# EAGLE design gnd-station_2023-2024_jlangl (EAGLE 9.7.0)
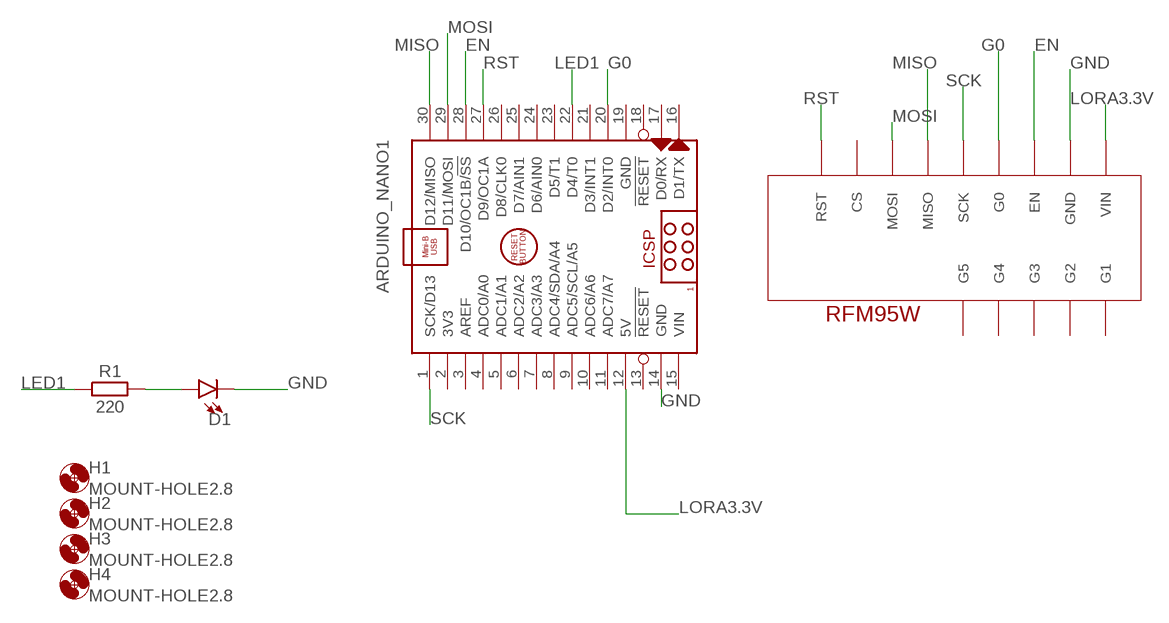
[diagram p0: schematic, sheet 1]

## Parts
ARDUINO_NANO1  ARDUINO_NANO  [ARDUINO_NANO]
D1  LED1206-BOTTOM  [LED-1206-BOTTOM]
H1  MOUNT-HOLE2.8  [2,8]
H2  MOUNT-HOLE2.8  [2,8]
H3  MOUNT-HOLE2.8  [2,8]
H4  MOUNT-HOLE2.8  [2,8]
R1  220  R_AXIAL-7.2MM-PITCH  [RESAD724W46L381D178B]
U1  ADAFRUIT_RFM95W_LORA_RADIO  [ADAFRUIT_RFM95W_LORA_RADIO]

## Nets
EN: ARDUINO_NANO1.28(D10/OC1B/!SS) U1.3(EN)
G0: ARDUINO_NANO1.20(D2/INT0) U1.4(G0)
GND: ARDUINO_NANO1.14(GND) D1.C U1.2(GND)
LED1: ARDUINO_NANO1.22(D4/T0) R1.1
LORA3.3V: ARDUINO_NANO1.12(5V) U1.1(VIN)
MISO: ARDUINO_NANO1.30(D12/MISO) U1.6(MISO)
MOSI: ARDUINO_NANO1.29(D11/MOSI) U1.7(MOSI)
N$2: D1.A R1.2
RST: ARDUINO_NANO1.27(D9/OC1A) U1.9(RST)
SCK: ARDUINO_NANO1.1(SCK/D13) U1.5(SCK)
Unconnected: ARDUINO_NANO1.2(3V3) ARDUINO_NANO1.3(AREF) ARDUINO_NANO1.4(ADC0/A0) ARDUINO_NANO1.5(ADC1/A1) ARDUINO_NANO1.6(ADC2/A2) ARDUINO_NANO1.7(ADC3/A3) ARDUINO_NANO1.8(ADC4/SDA/A4) ARDUINO_NANO1.9(ADC5/SCL/A5) ARDUINO_NANO1.10(ADC6/A6) ARDUINO_NANO1.11(ADC7/A7) ARDUINO_NANO1.13(!RESET) ARDUINO_NANO1.16(D1/TX) ARDUINO_NANO1.17(D0/RX) ARDUINO_NANO1.18(!RESET) ARDUINO_NANO1.21(D3/INT1) ARDUINO_NANO1.23(D5/T1) ARDUINO_NANO1.24(D6/AIN0) ARDUINO_NANO1.25(D7/AIN1) ARDUINO_NANO1.26(D8/CLK0) U1.8(CS) U1.10(G1) U1.11(G2) U1.12(G3) U1.13(G4) U1.14(G5)

## Power pins joined to a net without a drawn wire
GND: ARDUINO_NANO1.19(GND)
VIN: ARDUINO_NANO1.15(VIN)

## Library data of the parts
ARDUINO_NANO1 = ArduinoNanoV30:ARDUINO_NANO: Arduino Nano V3.0 Module Overview: The Arduino Nano is a small, complete, and breadboard-friendly board based on the ATmega328 (Arduino Nano 3.x) or ATmega168 (Arduino Nano 2.x). It has more or less the same functionality of the Arduino Duemilanove, but in a different package. It lacks only a DC power jack, and works with a Mini-B USB cable instead of a standard one. The Nano was designed and is being produced by Gravitech <http://www.gravitech.us/arna30wiatp.html>. General specifications: Item Value Microcontroller Atmel ATmega168 or ATmega328 Operating Voltage (logic level) 5 V Input Voltage (recommended) 7-12 V Input Voltage (limits) 6-20 V Digital I/O Pins 14 (of which 6 provide PWM output) Analog Input Pins 8 DC Current per I/O Pin 40 mA Flash Memory 16 KB (ATmega168) or 32 KB (ATmega328) of which 2 KB used by bootloader SRAM 1 KB (ATmega168) or 2 KB (ATmega328) EEPROM 512 bytes (ATmega168) or 1 KB (ATmega328) Clock Speed 16 MHz Dimensions (Inches) 0.73" x 1.70" Dimensions (mm) 18mm x 45mm Overall height About 9 mm (not including pins) Weigth 5 g Power: The Arduino Nano can be powered via the Mini-B USB connection, 6-20V unregulated external power supply (pin 30), or 5V regulated external power supply (pin 27). The power source is automatically selected to the highest voltage source. Memory: The ATmega168 has 16 KB of flash memory for storing code (of which 2 KB is used for the bootloader); the ATmega328 has 32 KB, (also with 2 KB used for the bootloader). The ATmega168 has 1 KB of SRAM and 512 bytes of EEPROM (which can be read and written with the EEPROM library); the ATmega328 has 2 KB of SRAM and 1 KB of EEPROM. Input and Output: Each of the 14 digital pins on the Nano can be used as an input or output, using pinMode(), digitalWrite(), and digitalRead() functions. They operate at 5 volts. Each pin can provide or receive a maximum of 40 mA and has an internal pull-up resistor (disconnected by default) of 20-50 kOhms. In addition, some pins have specialized functions. Visit Arduino - ArduinoBoardNano <https://www.arduino.cc/en/Main/ArduinoBoardNano>
D1 = SparkFun-LED:LED: LED (Generic) Standard schematic elements and footprints for 5mm, 3mm, 1206, and 0603 sized LEDs. Generic LEDs with no color specified.
H1-H4 = holes:MOUNT-HOLE: MOUNTING HOLE with drill center marker
R1 = Resistor:R: Resistor Fixed - Generic; CATEGORY: Resistor; SUB-CATEGORY: Fixed
U1 = AERO_Eagle_Library:ADAFRUIT_RFM95W_LORA_RADIO: Adafruit's LoRa Radio: RFM95W https://www.adafruit.com/product/3072

## Board
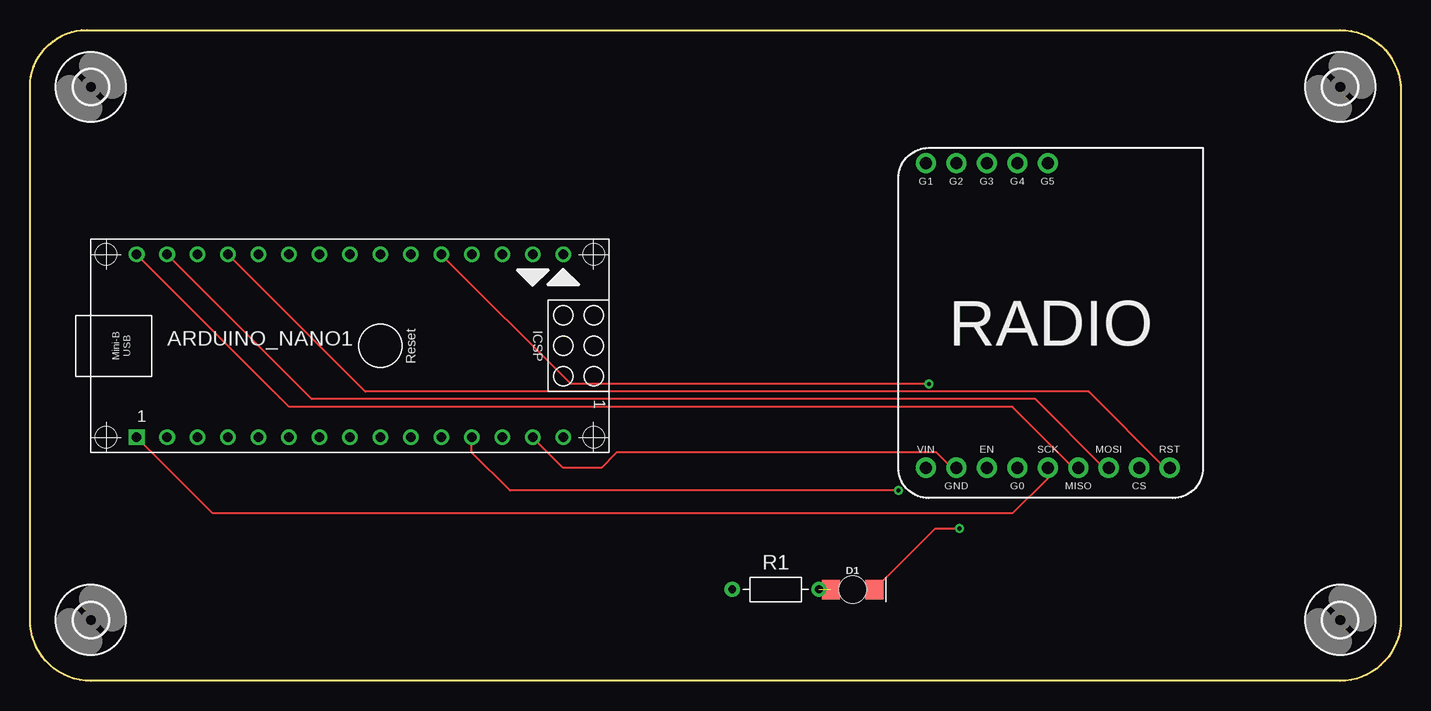
[diagram p1: board, top side]
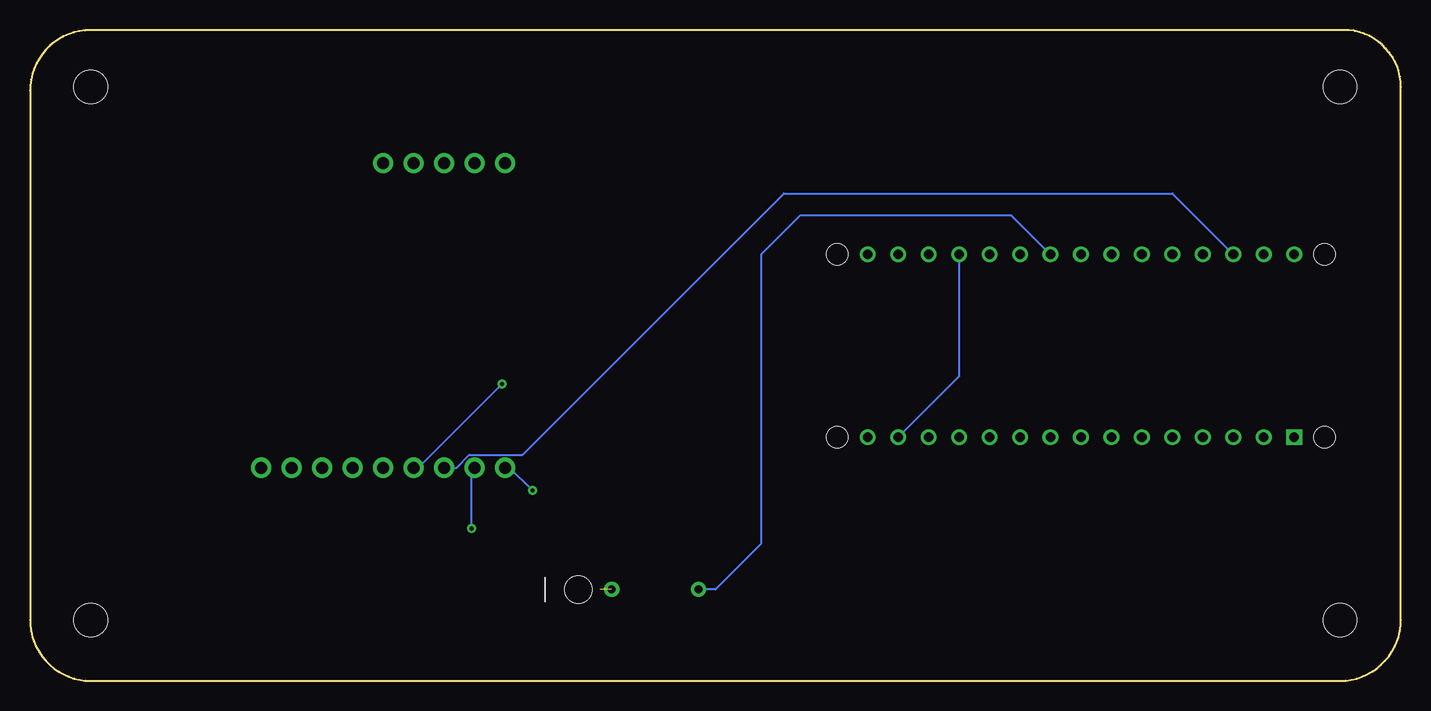
[diagram p2: board, bottom side, seen from below]

Size 114.28 x 54.28 mm. Coordinates in mm from the lower left corner, seen from the top.
Outline: 0,49.53 arc-90 4.75,54.28 109.22,54.28 arc-90 114.28,49.22 114.28,5.08 arc-90 109.2,0 5.08,0 arc-90 0,5.08 0,49.53
Copper layers (1*16): Top / Bottom
Stack-up Default Layer Stack: Top User Defined 0.035mm / Dielectric-1 User Defined 1.5mm / Bottom User Defined 0.035mm
Design rules "default": minimum track width 6mil, minimum drill 0.35mm, track to track 6mil, track to pad 6mil, pad to pad 6mil, via to via 6mil, smd to smd 6mil, copper to edge 40mil, drill to drill 6mil, minimum pad ring 10mil, minimum via ring 8mil, stop-mask expansion 4mil, vias tented up to drill 0mil, thermal gap 10mil

### Footprints (pad centres in the part's own frame; a part is rotated, then mirrored left to right if it is on the bottom)
ARDUINO_NANO = drill 0.8 square: 1 -20.32,-7.62 | drill 0.8: 2 -17.78,-7.62; 3 -15.24,-7.62; 4 -12.7,-7.62; 5 -10.16,-7.62; 6 -7.62,-7.62; 7 -5.08,-7.62; 8 -2.54,-7.62; 9 0,-7.62; 10 2.54,-7.62; 11 5.08,-7.62; 12 7.62,-7.62; 13 10.16,-7.62; 14 12.7,-7.62; 15 15.24,-7.62; 16 15.24,7.62; 17 12.7,7.62; 18 10.16,7.62; 19 7.62,7.62; 20 5.08,7.62; 21 2.54,7.62; 22 0,7.62; 23 -2.54,7.62; 24 -5.08,7.62; 25 -7.62,7.62; 26 -10.16,7.62; 27 -12.7,7.62; 28 -15.24,7.62; 29 -17.78,7.62; 30 -20.32,7.62 | hole 1.778: -22.86,-7.62; -22.86,7.62; 17.78,7.62; 17.78,-7.62
LED-1206-BOTTOM = smd 1.5 x 1.6: A -1.8,0; C 1.8,0 | hole 2.3: 0,0
2,8 = hole 2.8: 0,0
RESAD724W46L381D178B = drill 0.66 pad 1.26: 1 -3.62,0; 2 3.62,0
ADAFRUIT_RFM95W_LORA_RADIO = drill 1 pad 1.676: 1 2.29,-26.67; 2 4.83,-26.67; 3 7.37,-26.67; 4 9.91,-26.67; 5 12.45,-26.67; 6 14.99,-26.67; 7 17.53,-26.67; 8 20.07,-26.67; 9 22.61,-26.67; 10 2.29,-1.27; 11 4.83,-1.27; 12 7.37,-1.27; 13 9.91,-1.27; 14 12.45,-1.27

### Placement (x,y rotation side)
ARDUINO_NANO1  29.21,27.94 0 top
D1  68.58,7.62 0 top
H1  5.08,49.53 0 top
H2  109.22,49.53 0 top
H3  109.22,5.08 0 top
H4  5.08,5.08 0 top
R1  62.16,7.62 0 top
U1  72.39,44.45 0 top

### Tracks (layer width: path | path; a pad name or v marks a point on that pad's centre or on a via)
EN
  Bottom 0.152: ARDUINO_NANO1.28 19.05,40.64 51.44,40.64 73.23,18.85 77.66,18.85 78.73,17.78 U1.3
G0  (via drill 0.35)
  Top 0.152: ARDUINO_NANO1.20 45.09,24.77 v74.93,24.77
  Bottom 0.152: v74.93,24.77 81.92,17.78 U1.4
GND  (via drill 0.35)
  Top 0.152: ARDUINO_NANO1.14 44.45,17.78 47.62,17.78 48.9,19.05 75.56,19.05 76.83,17.78 U1.2 v77.47,17.53 | D1.C 75.46,12.7 v77.47,12.7
  Bottom 0.152: ARDUINO_NANO1.14 36.83,25.4 ARDUINO_NANO1.19 | v77.47,12.7 v77.47,17.53
LED1
  Bottom 0.152: R1.1 57.15,7.62 53.34,11.43 53.34,35.56 50.09,38.81 32.46,38.81 ARDUINO_NANO1.22
LORA3.3V  (via drill 0.35)
  Top 0.152: v72.39,15.88 40.01,15.88 36.83,19.05 ARDUINO_NANO1.12
  Bottom 0.152: v72.39,15.88 74.3,17.78 U1.1
MISO
  Top 0.152: ARDUINO_NANO1.30 21.59,22.86 81.92,22.86 87,17.78 U1.6
MOSI
  Top 0.152: ARDUINO_NANO1.29 23.5,23.5 83.82,23.5 89.53,17.78 U1.7
N$2  (1 unrouted)
RST
  Top 0.152: ARDUINO_NANO1.27 27.94,24.13 88.27,24.13 94.61,17.78 U1.9
SCK
  Top 0.152: ARDUINO_NANO1.1 15.24,13.97 81.92,13.97 84.84,16.89 U1.5